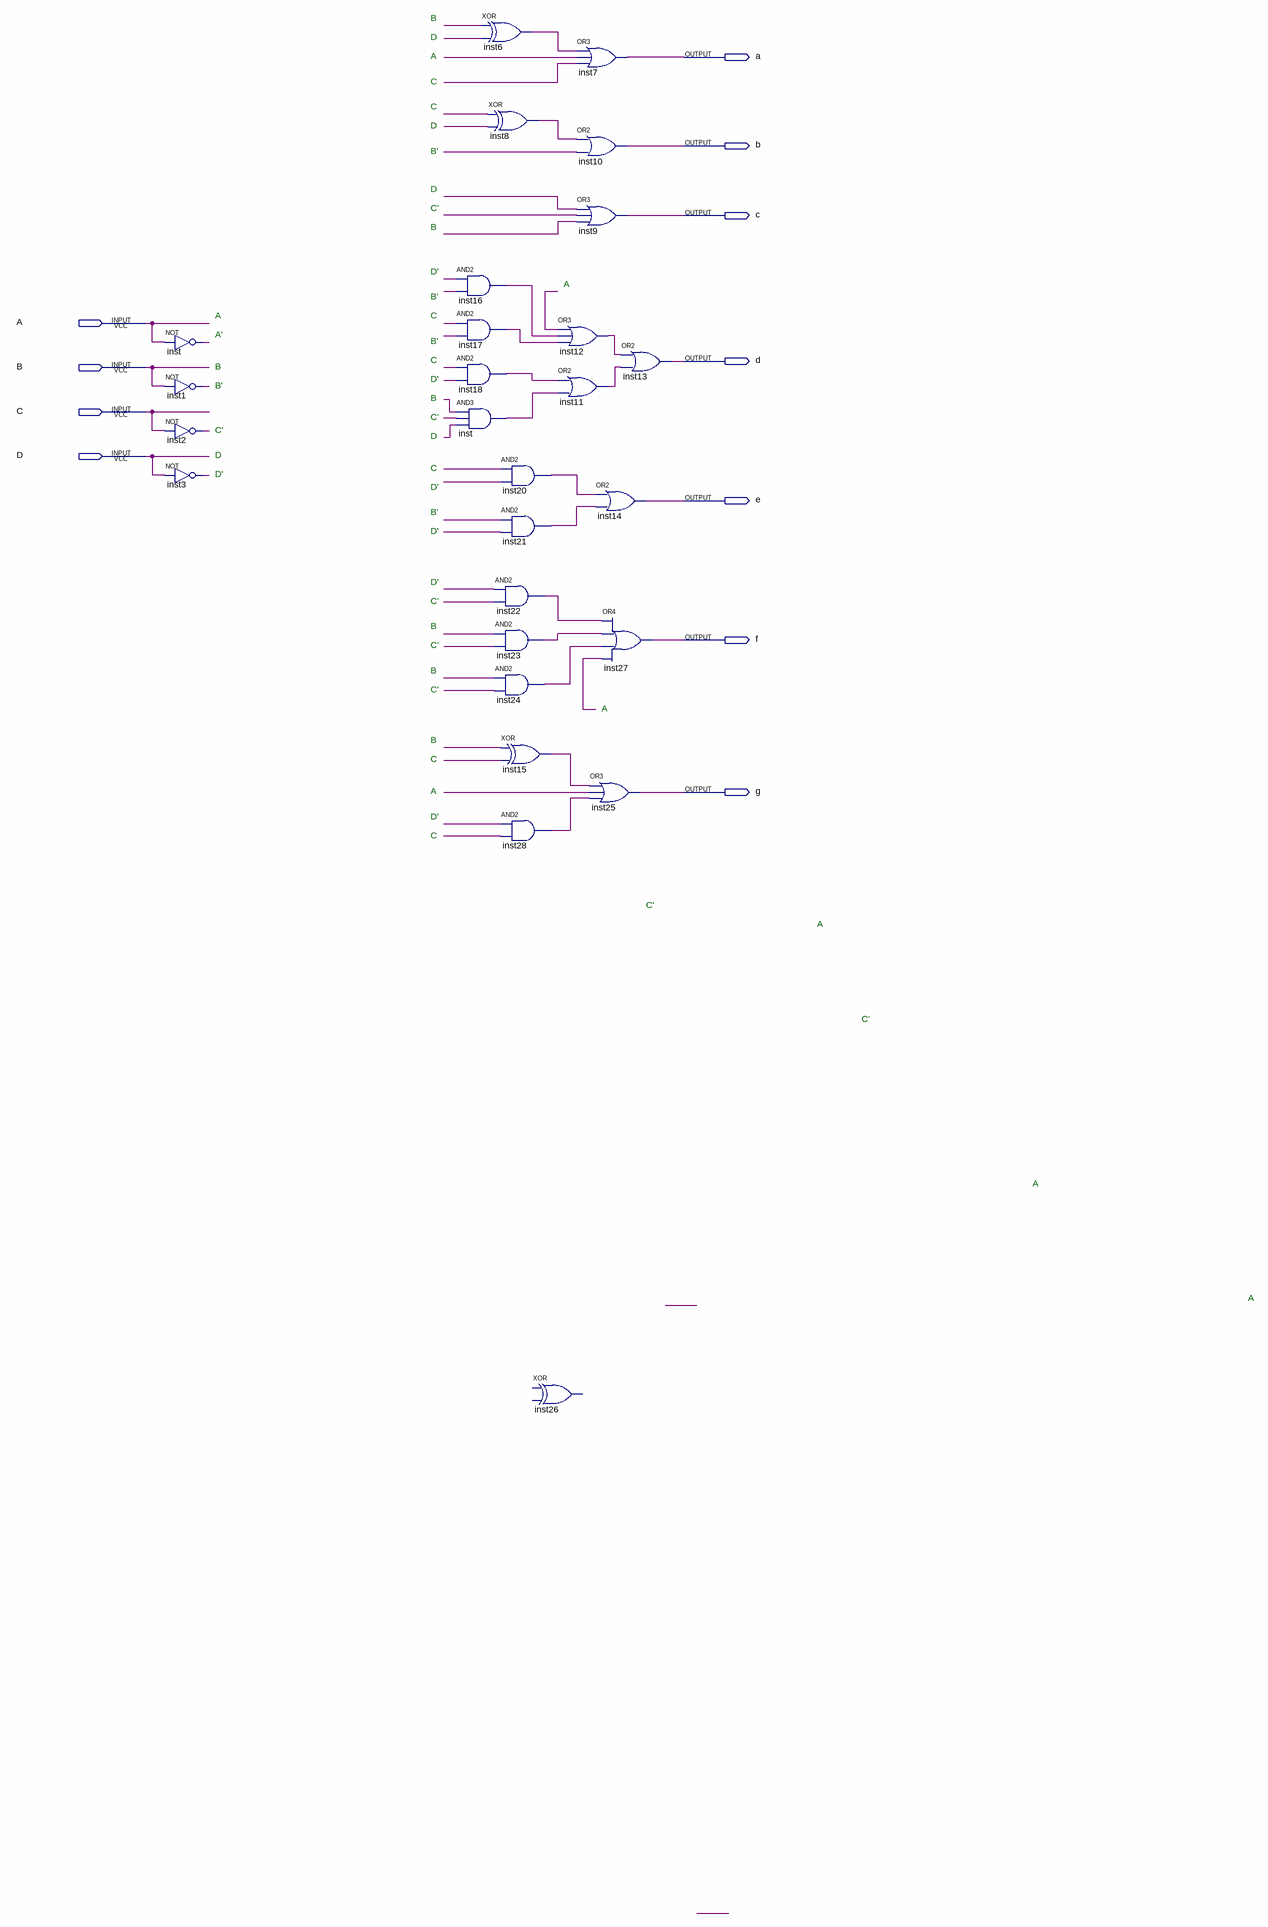
[diagram p0: schematic sheet]
// Quartus schematic Teste1.bdf as structural Verilog: 27 symbols, 11 pins
module Teste1 (
  inout  A,
  inout  B,
  inout  C,
  inout  D,
  output e,
  output f,
  output g
);

  wire inst1_out, inst2_out, inst3_out, inst6_out, inst8_out, inst11_out, inst12_out, inst15_out, inst16_out,
       inst17_out, inst18_out, inst20_out, inst21_out, inst22_out, inst23_out, inst24_out, inst28_out,
       inst_out, inst_out_2, undriven, undriven_2, undriven_3, undriven_4, undriven_5, undriven_6,
       undriven_7, undriven_8, undriven_9, undriven_10, undriven_11, undriven_12, undriven_13, undriven_14,
       undriven_15, undriven_16, undriven_17, undriven_18, undriven_19, undriven_20, undriven_21,
       undriven_22, undriven_23, undriven_24, undriven_25, undriven_26, undriven_27, undriven_28,
       undriven_29, undriven_30, undriven_31, undriven_32, undriven_33, undriven_34, undriven_35, undriven_36;

  not inst (inst_out_2, A);
  not inst1 (inst1_out, B);
  not inst2 (inst2_out, C);
  not inst3 (inst3_out, D);
  xor inst6 (inst6_out, undriven_3, undriven);
  and inst16 (inst16_out, undriven_11, undriven_12);
  and inst17 (inst17_out, undriven_13, undriven_14);
  and inst18 (inst18_out, undriven_15, undriven_16);
  and inst_dup2 (inst_out, undriven_36, undriven_35, undriven_34);
  xor inst8 (inst8_out, undriven_6, undriven_5);
  and inst20 (inst20_out, undriven_19, undriven_20);
  and inst21 (inst21_out, undriven_17, undriven_18);
  and inst22 (inst22_out, undriven_22, undriven_24);
  and inst23 (inst23_out, undriven_25, undriven_26);
  and inst24 (inst24_out, undriven_27, undriven_23);
  xor inst15 (inst15_out, undriven_28, undriven_30);
  and inst28 (inst28_out, undriven_31, undriven_29);
  // XOR inst26 is placed but not wired
  or inst7 (A, inst6_out, undriven_33, undriven_2);
  or inst10 (B, inst8_out, undriven_4);
  or inst9 (C, undriven_8, undriven_9, undriven_7);
  or inst12 (inst12_out, undriven_10, inst16_out, inst17_out);
  or inst11 (inst11_out, inst18_out, inst_out);
  or inst13 (D, inst12_out, inst11_out);
  or inst14 (e, inst20_out, inst21_out);
  or inst27 (f, inst22_out, inst23_out, inst24_out, undriven_21);
  or inst25 (g, inst15_out, undriven_32, inst28_out);

  // Notes on the sheet:
  //   B
  //   D
  //   A
  //   C
  //   C
  //   D
  //   B'
  //   D
  //   C'
  //   B
  //   D'
  //   A
  //   B'
  //   A
  //   C
  //   A'
  //   B'
  //   C
  //   B
  //   D'
  //   B'
  //   B
  //   C'
  //   C'
  //   D
  //   D
  //   C
  //   D'
  //   D'
  //   B'
  //   D'
  //   D'
  //   C'
  //   B
  //   C'
  //   B
  //   C'
  //   A
  //   B
  //   C
  //   A
  //   D'
  //   C
  //   C'
  //   A
  //   C'
  //   A
  //   A
endmodule
